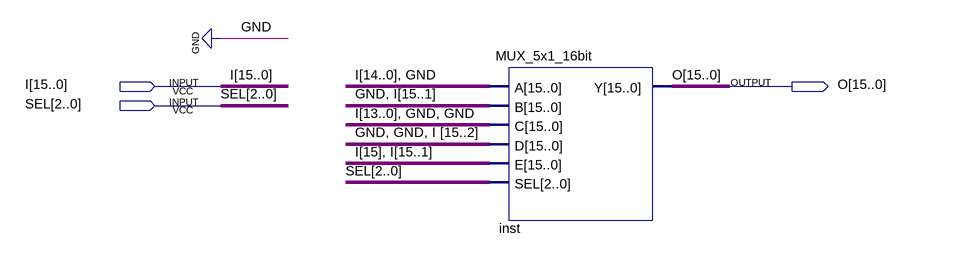
[diagram p0: schematic sheet]
// Quartus schematic Shifter.bdf as structural Verilog: 1 symbols, 3 pins
module Shifter (
  input  [15:0] I,
  input  [2:0] SEL,
  output [15:0] O
);

  MUX_5x1_16bit inst (
    .A({I[14:0], 1'b0}), .B({1'b0, I[15:1]}), .C({I[13:0], 2'b00}), .D({2'b00, I[15:2]}),
    .E({{2{I[15]}}, I[14:1]}), .SEL(SEL), .Y(O));
endmodule
